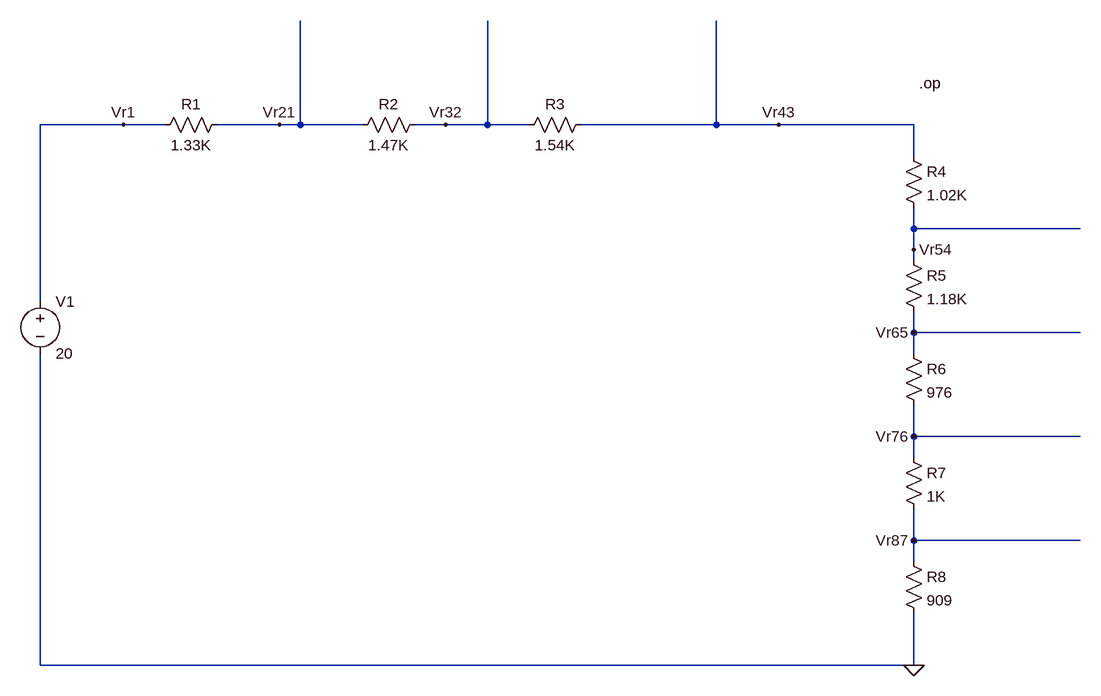
[diagram p0: schematic Resistor-Voltage Divider.asc]
Resistor-Voltage Divider.asc, the LTspice schematic file:
Version 4
SHEET 1 1172 864
WIRE -304 16 -432 16
WIRE -240 16 -304 16
WIRE -64 16 -160 16
WIRE -32 16 -32 -144
WIRE -32 16 -64 16
WIRE 64 16 -32 16
WIRE 192 16 144 16
WIRE 256 16 256 -144
WIRE 256 16 192 16
WIRE 320 16 256 16
WIRE 608 16 608 -144
WIRE 608 16 400 16
WIRE 704 16 608 16
WIRE 912 16 704 16
WIRE 912 64 912 16
WIRE 912 176 912 144
WIRE 1168 176 912 176
WIRE 912 208 912 176
WIRE 912 224 912 208
WIRE -432 288 -432 16
WIRE 912 336 912 304
WIRE 1168 336 912 336
WIRE 912 368 912 336
WIRE 912 496 912 448
WIRE 1168 496 912 496
WIRE 912 528 912 496
WIRE 912 656 912 608
WIRE 1168 656 912 656
WIRE 912 688 912 656
WIRE -432 848 -432 368
WIRE 912 848 912 768
WIRE 912 848 -432 848
FLAG -304 16 Vr1
FLAG -64 16 Vr21
FLAG 192 16 Vr32
FLAG 704 16 Vr43
FLAG 912 208 Vr54
FLAG 912 336 Vr65
FLAG 912 496 Vr76
FLAG 912 656 Vr87
FLAG 912 848 0
SYMBOL voltage -432 272 R0
SYMATTR InstName V1
SYMATTR Value 20
SYMBOL res -144 0 R90
WINDOW 0 0 56 VBottom 2
WINDOW 3 32 56 VTop 2
SYMATTR InstName R1
SYMATTR Value 1.33K
SYMBOL res 160 0 R90
WINDOW 0 0 56 VBottom 2
WINDOW 3 32 56 VTop 2
SYMATTR InstName R2
SYMATTR Value 1.47K
SYMBOL res 416 0 R90
WINDOW 0 0 56 VBottom 2
WINDOW 3 32 56 VTop 2
SYMATTR InstName R3
SYMATTR Value 1.54K
SYMBOL res 896 48 R0
SYMATTR InstName R4
SYMATTR Value 1.02K
SYMBOL res 896 208 R0
SYMATTR InstName R5
SYMATTR Value 1.18K
SYMBOL res 896 352 R0
SYMATTR InstName R6
SYMATTR Value 976
SYMBOL res 896 512 R0
SYMATTR InstName R7
SYMATTR Value 1K
SYMBOL res 896 672 R0
SYMATTR InstName R8
SYMATTR Value 909
TEXT 920 -48 Left 2 !.op

The netlist it stands for:
* Resistor-Voltage Divider.asc
V1 Vr1 0 20
R1 Vr21 Vr1 1.33K
R2 Vr32 Vr21 1.47K
R3 Vr43 Vr32 1.54K
R4 Vr43 Vr54 1.02K
R5 Vr54 Vr65 1.18K
R6 Vr65 Vr76 976
R7 Vr76 Vr87 1K
R8 Vr87 0 909
.op
.backanno
.end